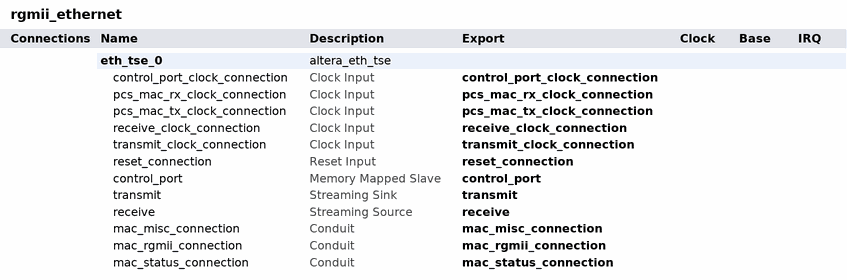
[diagram p0: system contents]
# Platform Designer (Qsys) system rgmii_ethernet, Cyclone 10 LP 10CL025YU256C8G
# Parameters at their usual value, and those the tool derives, are not listed.
package require -exact qsys 17.1
create_system rgmii_ethernet
set_project_property DEVICE_FAMILY {Cyclone 10 LP}
set_project_property DEVICE 10CL025YU256C8G

add_instance eth_tse_0 altera_eth_tse 17.1
set_instance_property eth_tse_0 AUTO_EXPORT true
set_instance_parameter_value eth_tse_0 XCVR_RCFG_JTAG_ENABLE 0
set_instance_parameter_value eth_tse_0 XCVR_SET_CAPABILITY_REG_ENABLE 0
set_instance_parameter_value eth_tse_0 XCVR_SET_CSR_SOFT_LOGIC_ENABLE 0
set_instance_parameter_value eth_tse_0 XCVR_SET_PRBS_SOFT_LOGIC_ENABLE 0
set_instance_parameter_value eth_tse_0 XCVR_SET_USER_IDENTIFIER 0
set_instance_parameter_value eth_tse_0 core_variation MAC_ONLY
set_instance_parameter_value eth_tse_0 enable_hd_logic true
set_instance_parameter_value eth_tse_0 enable_mac_flow_ctrl true
set_instance_parameter_value eth_tse_0 enable_magic_detect true
set_instance_parameter_value eth_tse_0 enable_shift16 true
set_instance_parameter_value eth_tse_0 ext_stat_cnt_ena true
set_instance_parameter_value eth_tse_0 ifGMII RGMII
set_instance_parameter_value eth_tse_0 ing_addr 11
set_instance_parameter_value eth_tse_0 mdio_clk_div 40
set_instance_parameter_value eth_tse_0 stat_cnt_ena true
set_instance_parameter_value eth_tse_0 transceiver_type NONE
set_instance_parameter_value eth_tse_0 useMDIO false

# exported interfaces
add_interface control_port avalon slave
set_interface_property control_port EXPORT_OF eth_tse_0.control_port
add_interface control_port_clock_connection clock sink
set_interface_property control_port_clock_connection EXPORT_OF eth_tse_0.control_port_clock_connection
add_interface mac_misc_connection conduit end
set_interface_property mac_misc_connection EXPORT_OF eth_tse_0.mac_misc_connection
add_interface mac_rgmii_connection conduit end
set_interface_property mac_rgmii_connection EXPORT_OF eth_tse_0.mac_rgmii_connection
add_interface mac_status_connection conduit end
set_interface_property mac_status_connection EXPORT_OF eth_tse_0.mac_status_connection
add_interface pcs_mac_rx_clock_connection clock sink
set_interface_property pcs_mac_rx_clock_connection EXPORT_OF eth_tse_0.pcs_mac_rx_clock_connection
add_interface pcs_mac_tx_clock_connection clock sink
set_interface_property pcs_mac_tx_clock_connection EXPORT_OF eth_tse_0.pcs_mac_tx_clock_connection
add_interface receive avalon_streaming source
set_interface_property receive EXPORT_OF eth_tse_0.receive
add_interface receive_clock_connection clock sink
set_interface_property receive_clock_connection EXPORT_OF eth_tse_0.receive_clock_connection
add_interface reset_connection reset sink
set_interface_property reset_connection EXPORT_OF eth_tse_0.reset_connection
add_interface transmit avalon_streaming sink
set_interface_property transmit EXPORT_OF eth_tse_0.transmit
add_interface transmit_clock_connection clock sink
set_interface_property transmit_clock_connection EXPORT_OF eth_tse_0.transmit_clock_connection

set_interconnect_requirement {$system} qsys_mm.clockCrossingAdapter HANDSHAKE
set_interconnect_requirement {$system} qsys_mm.enableEccProtection FALSE
set_interconnect_requirement {$system} qsys_mm.insertDefaultSlave FALSE
set_interconnect_requirement {$system} qsys_mm.maxAdditionalLatency 1

save_system rgmii_ethernet.qsys
